# EAGLE schematic fduino (EAGLE 9.3.1)
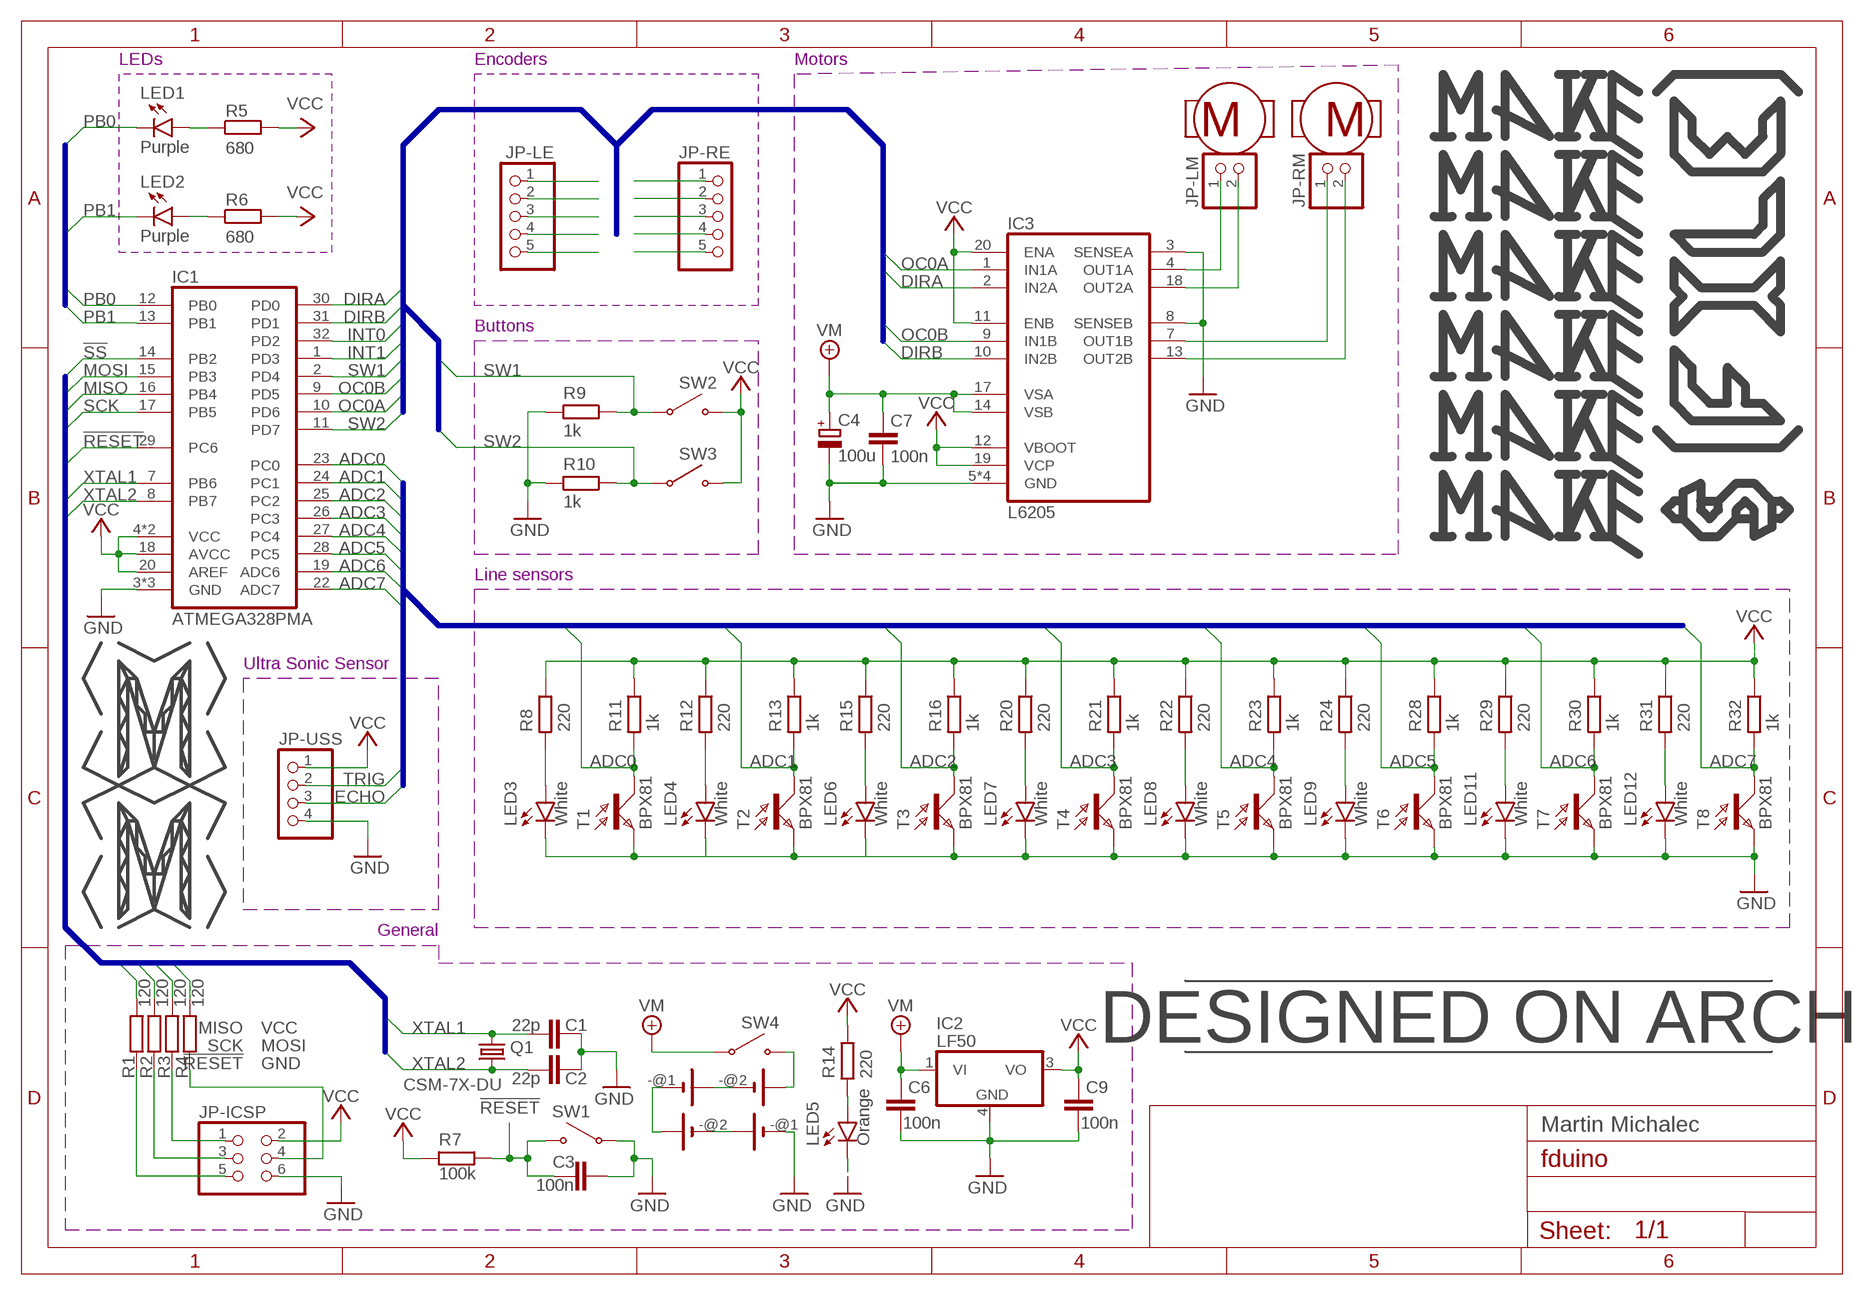
[diagram p0: schematic, sheet 1]

## Parts
C1  22p  C-EUC1206  [C1206]
C2  22p  C-EUC1206  [C1206]
C3  100n  C-EUC1206  [C1206]
C4  100u  CPOL-EUSMCD  [SMC_D]
C6  100n  C-EUC1206  [C1206]
C7  100n  C-EUC1206  [C1206]
C9  100n  C-EUC1206  [C1206]
IC1  ATMEGA328PMA  [TQFP32]
IC2  LF50  LM340MP-05  [SOT223]
IC3  L6205  [SO20]
JP-ICSP  PINHD-2X3  [2X03]
JP-LE  PINHD-1X5  [1X05]
JP-LM  PINHD-1X2  [1X02]
JP-RE  PINHD-1X5  [1X05]
JP-RM  PINHD-1X2  [1X02]
JP-USS  PINHD-1X4  [1X04]
LED1  Purple  LEDSML1206  [SML1206]
LED2  Purple  LEDSML1206  [SML1206]
LED3  White  LEDSML1206  [SML1206]
LED4  White  LEDSML1206  [SML1206]
LED5  Orange  LEDSML1206  [SML1206]
LED6  White  LEDSML1206  [SML1206]
LED7  White  LEDSML1206  [SML1206]
LED8  White  LEDSML1206  [SML1206]
LED9  White  LEDSML1206  [SML1206]
LED11  White  LEDSML1206  [SML1206]
LED12  White  LEDSML1206  [SML1206]
Q1  CSM-7X-DU  [CSM-7X-DU]
R1  120  R-EU_R1206  [R1206]
R2  120  R-EU_R1206  [R1206]
R3  120  R-EU_R1206  [R1206]
R4  120  R-EU_R1206  [R1206]
R5  680  R-EU_R1206  [R1206]
R6  680  R-EU_R1206  [R1206]
R7  100k  R-EU_R1206  [R1206]
R8  220  R-EU_R1206  [R1206]
R9  1k  R-EU_R1206  [R1206]
R10  1k  R-EU_R1206  [R1206]
R11  1k  R-EU_R1206  [R1206]
R12  220  R-EU_R1206  [R1206]
R13  1k  R-EU_R1206  [R1206]
R14  220  R-EU_R1206  [R1206]
R15  220  R-EU_R1206  [R1206]
R16  1k  R-EU_R1206  [R1206]
R20  220  R-EU_R1206  [R1206]
R21  1k  R-EU_R1206  [R1206]
R22  220  R-EU_R1206  [R1206]
R23  1k  R-EU_R1206  [R1206]
R24  220  R-EU_R1206  [R1206]
R28  1k  R-EU_R1206  [R1206]
R29  220  R-EU_R1206  [R1206]
R30  1k  R-EU_R1206  [R1206]
R31  220  R-EU_R1206  [R1206]
R32  1k  R-EU_R1206  [R1206]
SW1  SWITCHTHT  [SWITCH]
SW2  SWITCHTHT  [SWITCH]
SW3  SWITCHTHT  [SWITCH]
SW4  SWITCHTHT  [SWITCH]
T1  BPX81  [BPX81]
T2  BPX81  [BPX81]
T3  BPX81  [BPX81]
T4  BPX81  [BPX81]
T5  BPX81  [BPX81]
T6  BPX81  [BPX81]
T7  BPX81  [BPX81]
T8  BPX81  [BPX81]
U$2  BAT  [BAT2X18650]
U$3  BAT  [BAT2X18650]

## Nets
!RESET: C3.1 IC1.29(PC6) R1.2 R7.2 SW1.P$2
!SS: IC1.14(PB2)
ADC0: IC1.23(PC0) R11.2 T1.C
ADC1: IC1.24(PC1) R13.2 T2.C
ADC2: IC1.25(PC2) R16.2 T3.C
ADC3: IC1.26(PC3) R21.2 T4.C
ADC4: IC1.27(PC4) R23.2 T5.C
ADC5: IC1.28(PC5) R28.2 T6.C
ADC6: IC1.19(ADC6) R30.2 T7.C
ADC7: IC1.22(ADC7) R32.2 T8.C
DIRA: IC1.30(PD0) IC3.2(IN2A)
DIRB: IC1.31(PD1) IC3.10(IN2B)
ECHO: JP-USS.3
GND: C1.1 C2.1 C3.2 C4.- C6.2 C7.2 C9.2 IC1.3(GND) IC1.5(GND) IC1.21(GND) IC2.4(GND) IC3.3(SENSEA) IC3.5(GND) IC3.6(GND) IC3.8(SENSEB) IC3.15(GND) IC3.16(GND) JP-ICSP.6 JP-USS.4 LED5.C R9.2 R10.2 SW1.P$1 U$3.-@1(A:-)
GND2: LED3.C LED4.C LED6.C LED7.C LED8.C LED9.C LED11.C LED12.C T1.E T2.E T3.E T4.E T5.E T6.E T7.E T8.E ; supply symbol labelled GND
INT0: IC1.32(PD2)
INT1: IC1.1(PD3)
MISO: IC1.16(PB4) R3.2
MOSI: IC1.15(PB3) R4.2
N$1: LED6.A R15.2
N$3: IC3.13(OUT2B) JP-RM.2
N$4: LED2.A R6.1
N$5: LED1.A R5.1
N$6: IC3.7(OUT1B) JP-RM.1
N$7: IC3.4(OUT1A) JP-LM.1
N$8: IC3.18(OUT2A) JP-LM.2
N$9: U$3.+@1(A:+) U$3.-@2(B:-)
N$10: U$2.+@1(A:+) U$2.-@2(B:-)
N$12: LED7.A R20.2
N$13: JP-LE.5
N$14: SW4.P$2 U$2.+@2(B:+)
N$15: U$2.-@1(A:-) U$3.+@2(B:+)
N$22: LED12.A R31.2
N$23: LED8.A R22.2
N$24: R20.1
N$26: JP-LE.4
N$27: LED9.A R24.2
N$28: R22.1
N$29: JP-LE.3
N$30: LED11.A R29.2
N$31: JP-LE.2
N$32: R15.1
N$33: JP-ICSP.1 R3.1
N$34: JP-LE.1
N$35: R24.1
N$36: LED5.A R14.2
N$37: JP-RE.1
N$38: R29.1
N$39: JP-RE.3
N$40: R12.1
N$41: R31.1
N$42: R11.1 R13.1 R16.1 R21.1 R23.1 R28.1 R30.1 R32.1
N$43: LED4.A R12.2
N$44: JP-RE.2
N$45: R8.1
N$46: JP-RE.5
N$47: LED3.A R8.2
N$48: JP-RE.4
N$49: JP-ICSP.3 R2.1
N$50: JP-ICSP.5 R1.1
N$51: JP-ICSP.4 R4.1
OC0A: IC1.10(PD6) IC3.1(IN1A)
OC0B: IC1.9(PD5) IC3.9(IN1B)
PB0: IC1.12(PB0) LED1.C
PB1: IC1.13(PB1) LED2.C
SCK: IC1.17(PB5) R2.2
SW1: IC1.2(PD4) R9.1 SW2.P$1
SW2: IC1.11(PD7) R10.1 SW3.P$1
TRIG: JP-USS.2
VCC: C9.1 IC1.4(VCC) IC1.6(VCC) IC1.18(AVCC) IC1.20(AREF) IC2.3(VO) IC3.11(ENB) IC3.12(VBOOT) IC3.19(VCP) IC3.20(ENA) JP-ICSP.2 JP-USS.1 R5.2 R6.2 R7.1 R14.1 SW2.P$2 SW3.P$2
VM: C4.+ C6.1 C7.1 IC2.1(VI) IC3.14(VSB) IC3.17(VSA) SW4.P$1
XTAL1: C1.2 IC1.7(PB6) Q1.2
XTAL2: C2.2 IC1.8(PB7) Q1.1

## Buses
MISO,MOSI,MOSIR,!RESET,SCK,!SS,XTAL1,XTAL2
DIRA,DIRB,INT0,INT1,OC0A,OC0B,SW1,SW2
ADC0,ADC1,ADC2,ADC3,ADC4,ADC5,ADC6,ADC7,ECHO,TRIG
PB0,PB1

## Notes on the sheet
- LEDs | Encoders | Motors
- Buttons
- Line sensors
- Ultra Sonic Sensor
- General
- DESIGNED ON ARCH
- Martin Michalec

## Library data of the parts
C1-C3 C6 C7 C9 = rcl:C-EU: CAPACITOR, European symbol; SPICEPREFIX: C
C4 = rcl:CPOL-EU: POLARIZED CAPACITOR, European symbol; SPICEPREFIX: C
IC1 = martinmake:ATMEGA328P: 32A, 32-lead, 7 x 7 mm Body Size, 1.0 mm Body Thickness, 0.8 mm Lead Pitch, Thin Profile Plastic Quad Flat Package (TQFP)
IC2 = linear:LM340?-*: Positive VOLTAGE REGULATOR Source: http://cache.national.com/ds/LM/LM340.pdf
IC3 = martinmake:L6205
JP-ICSP = pinhead:PINHD-2X3: PIN HEADER
JP-LE JP-RE = pinhead:PINHD-1X5: PIN HEADER
JP-LM JP-RM = pinhead:PINHD-1X2: PIN HEADER
JP-USS = pinhead:PINHD-1X4: PIN HEADER
LED1-LED9 LED11 LED12 = led:LED: LED OSRAM: - CHIPLED LG R971, LG N971, LY N971, LG Q971, LY Q971, LO R971, LY R971 LH N974, LH R974 LS Q976, LO Q976, LY Q976 LO Q996 - Hyper CHIPLED LW Q18S LB Q993, LB Q99A, LB R99A - SideLED LS A670, LO A670, LY A670, LG A670, LP A670 LB A673, LV A673, LT A673, LW A673 LH A674 LY A675 LS A676, LA A676, LO A676, LY A676, LW A676 LS A679, LY A679, LG A679 - Hyper Micro SIDELED® LS Y876, LA Y876, LO Y876, LY Y876 LT Y87S - SmartLED LW L88C, LW L88S LB L89C, LB L89S, LG L890 LS L89K, LO L89K, LY L89K LS L896, LA L896, LO L896, LY L896 - TOPLED LS T670, LO T670, LY T670, LG T670, LP T670 LSG T670, LSP T670, LSY T670, LOP T670, LYG T670 LG T671, LOG T671, LSG T671 LB T673, LV T673, LT T673, LW T673 LH T674 LS T676, LA T676, LO T676, LY T676, LB T676, LH T676, LSB T676, LW T676 LB T67C, LV T67C, LT T67C, LS T67K, LO T67K, LY T67K, LW E67C LS E67B, LA E67B, LO E67B, LY E67B, LB E67C, LV E67C, LT E67C LW T67C LS T679, LY T679, LG T679 LS T770, LO T770, LY T770, LG T770, LP T770 LB T773, LV T773, LT T773, LW T773 LH T774 LS E675, LA E675, LY E675, LS T675 LS T776, LA T776, LO T776, LY T776, LB T776 LHGB T686 LT T68C, LB T68C - Hyper Mini TOPLED® LB M676 - Mini TOPLED Santana® LG M470 LS M47K, LO M47K, LY M47K Source: http://www.osram.convergy.de LUXEON: - LUMILED® LXK2-PW12-R00, LXK2-PW12-S00, LXK2-PW14-U00, LXK2-PW14-V00 LXK2-PM12-R00, LXK2-PM12-S00, LXK2-PM14-U00 LXK2-PE12-Q00, LXK2-PE12-R00, LXK2-PE12-S00, LXK2-PE14-T00, LXK2-PE14-U00 LXK2-PB12-K00, LXK2-PB12-L00, LXK2-PB12-M00, LXK2-PB14-N00, LXK2-PB14-P00, LXK2-PB14-Q00 LXK2-PR12-L00, LXK2-PR12-M00, LXK2-PR14-Q00, LXK2-PR14-R00 LXK2-PD12-Q00, LXK2-PD12-R00, LXK2-PD12-S00 LXK2-PH12-R00, LXK2-PH12-S00 LXK2-PL12-P00, LXK2-PL12-Q00, LXK2-PL12-R00 Source: www.luxeon.com KINGBRIGHT: KA-3528ASYC Source: www.kingbright.com
Q1 = crystal:CSM-7X-DU: SMD CRYSTAL Source: www.ecsxtal.com .. Crystal 3.6864MHz CSM_7X_DU.PDF; OC_FARNELL: unknown; OC_NEWARK: unknown
R1-R16 R20-R24 R28-R32 = rcl:R-EU_: RESISTOR, European symbol; SPICEPREFIX: R
SW1-SW4 = martinmake:SWITCH
T1-T8 = opto-trans-siemens:BPX81: PHOTO TRANSISTOR; OC_FARNELL: unknown; OC_NEWARK: unknown
U$2 U$3 = martinmake:BAT: LI BATTERY Varta